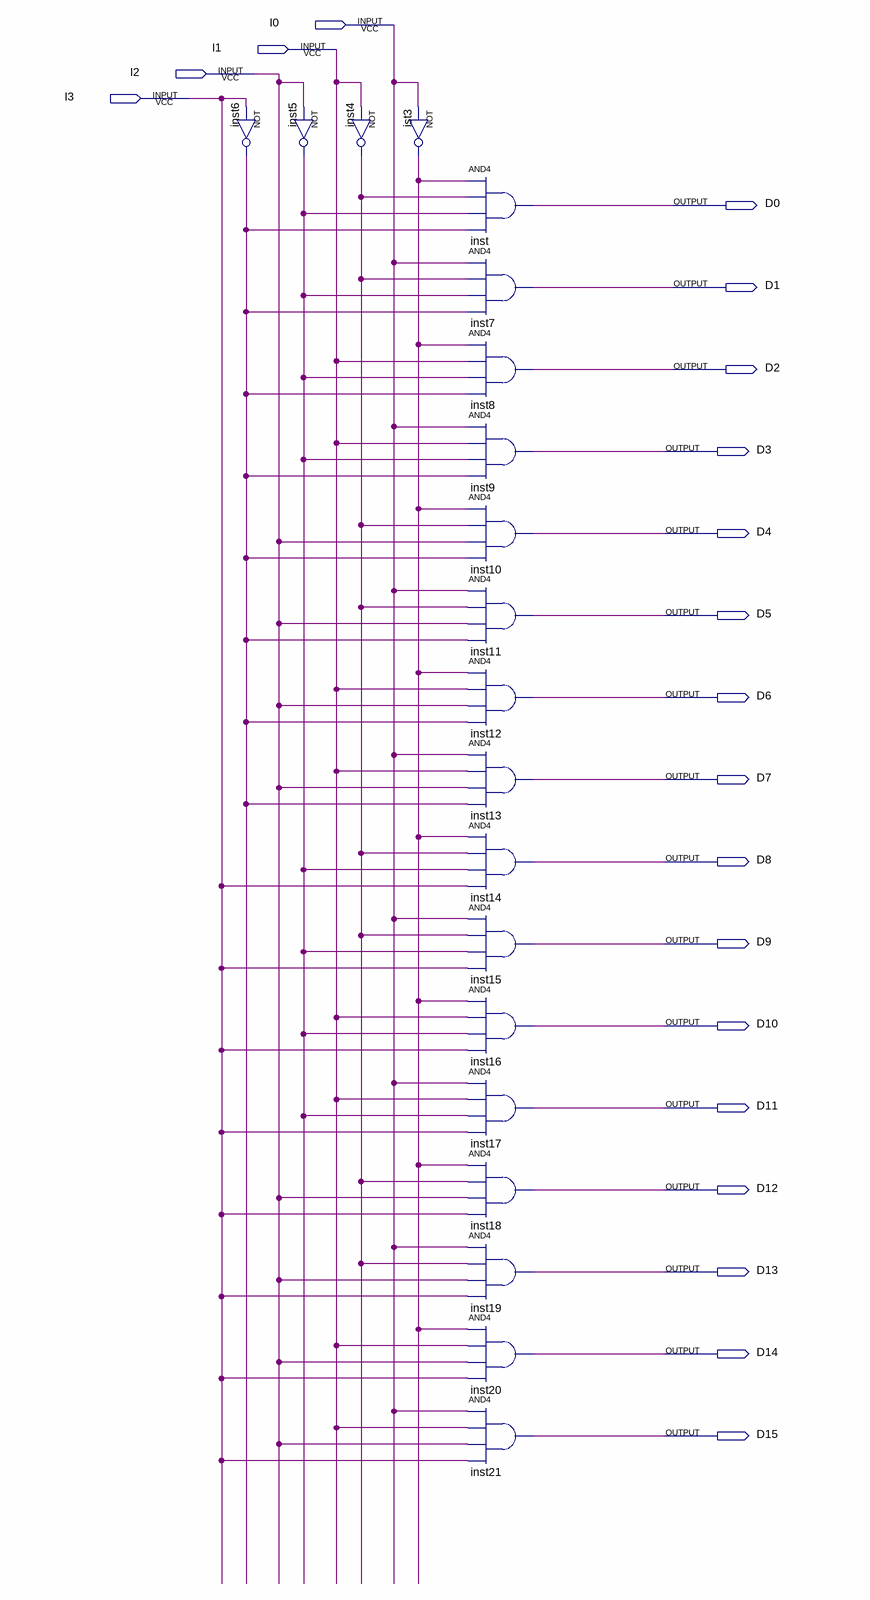
[diagram p0: schematic sheet]
// Quartus schematic Lablsd4.bdf as structural Verilog: 20 symbols, 20 pins
module Lablsd4 (
  input  I0,
  input  I1,
  input  I2,
  input  I3,
  output D0,
  output D1,
  output D2,
  output D3,
  output D4,
  output D5,
  output D6,
  output D7,
  output D8,
  output D9,
  output D10,
  output D11,
  output D12,
  output D13,
  output D14,
  output D15
);

  wire inst4_out, inst5_out, inst6_out, ist3_out;

  not inst6 (inst6_out, I3);
  not inst5 (inst5_out, I2);
  not inst4 (inst4_out, I1);
  not ist3 (ist3_out, I0);
  and inst (D0, ist3_out, inst4_out, inst5_out, inst6_out);
  and inst7 (D1, I0, inst4_out, inst5_out, inst6_out);
  and inst8 (D2, ist3_out, I1, inst5_out, inst6_out);
  and inst9 (D3, I0, I1, inst5_out, inst6_out);
  and inst10 (D4, ist3_out, inst4_out, I2, inst6_out);
  and inst11 (D5, I0, inst4_out, I2, inst6_out);
  and inst12 (D6, ist3_out, I1, I2, inst6_out);
  and inst13 (D7, I0, I1, I2, inst6_out);
  and inst14 (D8, ist3_out, inst4_out, inst5_out, I3);
  and inst15 (D9, I0, inst4_out, inst5_out, I3);
  and inst16 (D10, ist3_out, I1, inst5_out, I3);
  and inst17 (D11, I0, I1, inst5_out, I3);
  and inst18 (D12, ist3_out, inst4_out, I2, I3);
  and inst19 (D13, I0, inst4_out, I2, I3);
  and inst20 (D14, ist3_out, I1, I2, I3);
  and inst21 (D15, I0, I1, I2, I3);
endmodule
